# Altium schematic sheet power.SchDoc
size A4; SheetNumber: 4; SheetTotal: 11
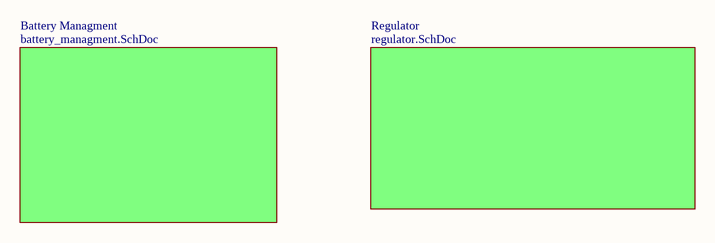
[diagram p0: power.SchDoc]

## Sub-sheets
Battery Managment = battery_managment.SchDoc: no entries
Regulator = regulator.SchDoc: no entries